# Altium schematic sheet 07_MCU.SchDoc: MCU
size A4; Author: Gabriel; Organization: Altium Limited; Address1: L3, 12a Rodborough Rd; Address2: Frenchs Forest; Address3: NSW; Address4: Australia 2086; Revision: v2.0; SheetNumber: 7; SheetTotal: 8; Subtitle: XDRONE
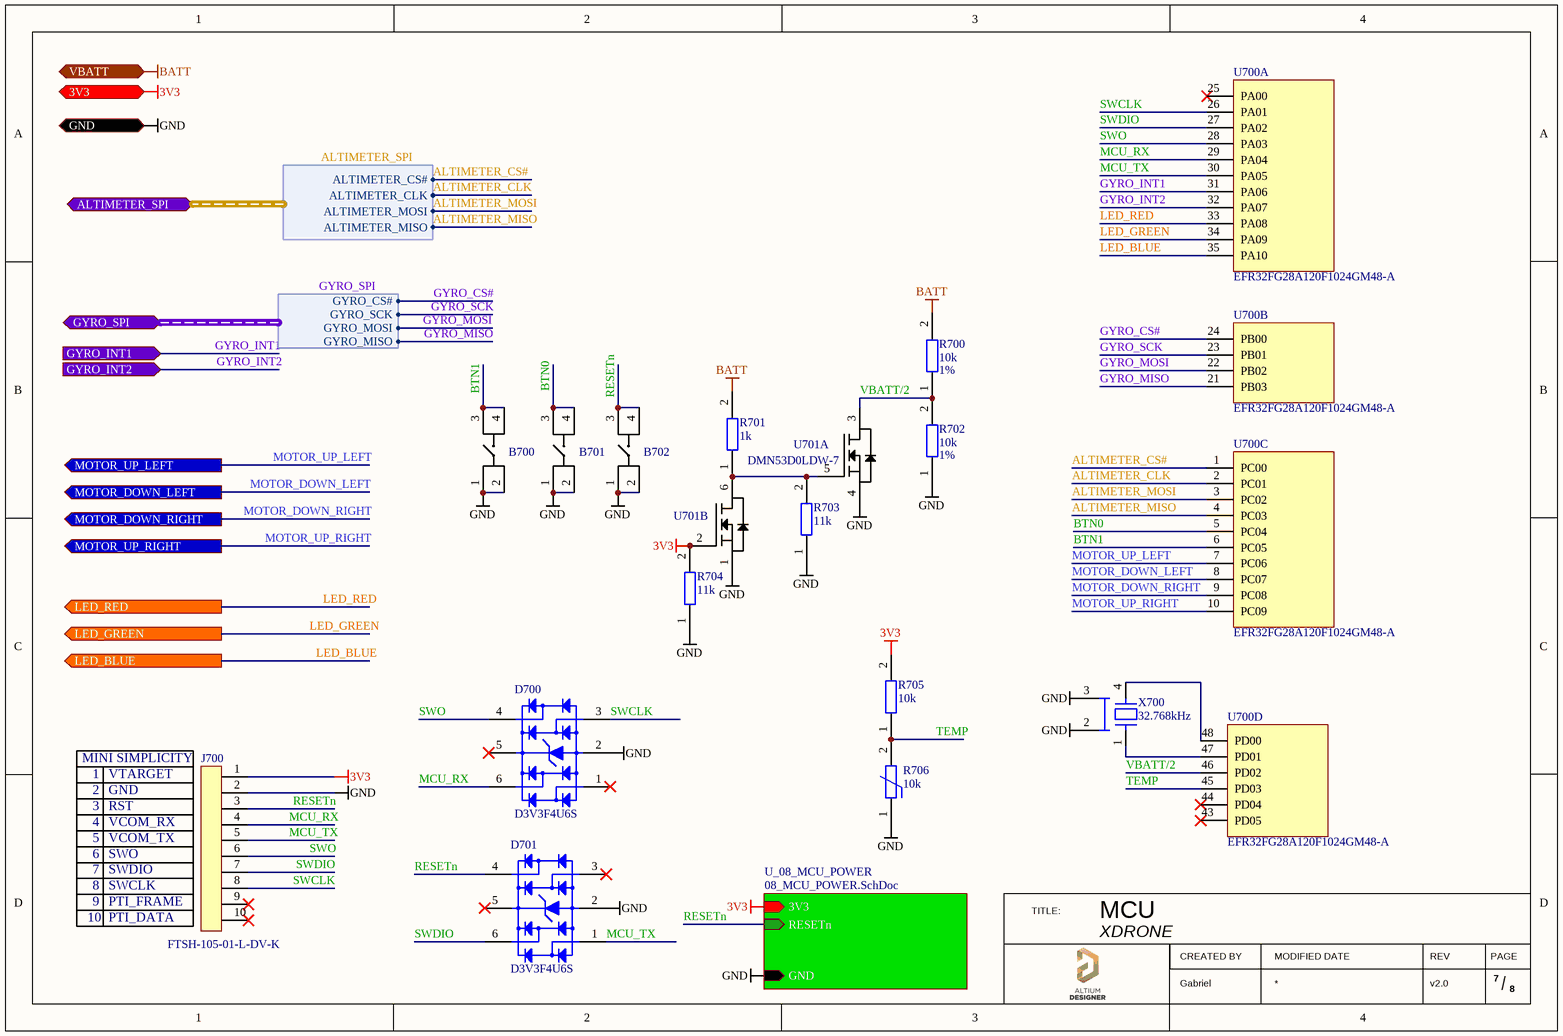
[diagram p0: 07_MCU.SchDoc]

## Parts
B700  BTN_1B_PTS647SK38SMTR2LFS  [BTN_SMD]  (value not drawn)
B701  BTN_1B_PTS647SK38SMTR2LFS  [BTN_SMD]  (value not drawn)
B702  BTN_1B_PTS647SK38SMTR2LFS  [BTN_SMD]  (value not drawn)
D700  MANUFACTURER REFERENCE: D3V3F4U6S  [SOT-363 SC-70-6]  (hidden comment: ESD_D3V3F4U6S)
D701  MANUFACTURER REFERENCE: D3V3F4U6S  [SOT-363 SC-70-6]  (hidden comment: ESD_D3V3F4U6S)
J700  MANUFACTURER REFERENCE: FTSH-105-01-L-DV-K  [CON_5x2PIN_RA_FTSH-105-01-L-DV-K]  (hidden comment: CON_5x2PIN_RA_1.27_FTSH-105-01-L-DV-K)
R700  value 10k  TOLERANCE: 1%  [RES_0402]  (hidden comment: RES_10k_1%_0402_RC0402FR-0710KL)
R701  value 1k  [RES_0402]  (hidden comment: RES_1k_1%_0402_RC0402FR-071KL)
R702  value 10k  TOLERANCE: 1%  [RES_0402]  (hidden comment: RES_10k_1%_0402_RC0402FR-0710KL)
R703  value 11k  [RES_0402]  (hidden comment: RES_11k_5%_0402_ERJ-2GEJ113X)
R704  value 11k  [RES_0402]  (hidden comment: RES_11k_5%_0402_ERJ-2GEJ113X)
R705  value 10k  [RES_0402]  (hidden comment: RES_10k_1%_0402_RC0402FR-0710KL)
R706  value 10k  [RES_0402]  (hidden comment: THER_10k_1%_0402_NTCG103JF103FT1)
U700  MANUFACTURER REFERENCE: EFR32FG28A120F1024GM48-A  [QFN48]  (hidden comment: MCU_1MB_256kB_EFR32FG28A120F1024GM48-A)  (parts A,B,C,D of 6)
U701  MANUFACTURER REFERENCE: DMN53D0LDW-7  [SOT-363 SC-70-6]  (hidden comment: MOS_2G_50VDS_360mA_0.8Vth_DMN53D0LDW-7)  (parts A,B of 2)
X700  FREQUENCY: 32.768kHz  [4-SOJ]  (hidden comment: QUARTZ_32.768kHz_20ppm_830016178)

## Sub-sheets
U_08_MCU_POWER = 08_MCU_POWER.SchDoc: GND (in), 3V3 (in), RESETn (in)

## Ports
3V3 (in), ALTIMETER_SPI (harness ALTIMETER_SPI), GND (in), GYRO_INT1 (in), GYRO_INT2 (in), GYRO_SPI (harness GYRO_SPI), LED_BLUE (out), LED_GREEN (out), LED_RED (out), MOTOR_DOWN_LEFT (out), MOTOR_DOWN_RIGHT (out), MOTOR_UP_LEFT (out), MOTOR_UP_RIGHT (out), VBATT (in)

## Harnesses
ALTIMETER_SPI: ALTIMETER_MISO, ALTIMETER_MOSI, ALTIMETER_CLK, ALTIMETER_CS#
GYRO_SPI: GYRO_CS#, GYRO_SCK, GYRO_MOSI, GYRO_MISO

## Nets
3V3: J700.1 R704.2 R705.2 U701.2 ; port 3V3, sheet U_08_MCU_POWER/3V3
BATT: R700.2 R701.2 ; port VBATT
GND: B700.1 B700.2 B701.1 B701.2 B702.1 B702.2 D700.2 D701.2 J700.2 R702.1 R703.1 R704.1 R706.1 U701.1 U701.4 X700.2 X700.3 ; port GND, sheet U_08_MCU_POWER/GND
ALTIMETER_CLK: U700.2(PC01) ; port ALTIMETER_SPI.ALTIMETER_CLK
ALTIMETER_CS#: U700.1(PC00) ; port ALTIMETER_SPI.ALTIMETER_CS#
ALTIMETER_MISO: U700.4(PC03) ; port ALTIMETER_SPI.ALTIMETER_MISO
ALTIMETER_MOSI: U700.3(PC02) ; port ALTIMETER_SPI.ALTIMETER_MOSI
BTN0: B701.3 B701.4 U700.5(PC04)
BTN1: B700.3 B700.4 U700.6(PC05)
GYRO_CS#: U700.24(PB00) ; port GYRO_SPI.GYRO_CS#
GYRO_INT1: U700.31(PA06) ; port GYRO_INT1
GYRO_INT2: U700.32(PA07) ; port GYRO_INT2
GYRO_MISO: U700.21(PB03) ; port GYRO_SPI.GYRO_MISO
GYRO_MOSI: U700.22(PB02) ; port GYRO_SPI.GYRO_MOSI
GYRO_SCK: U700.23(PB01) ; port GYRO_SPI.GYRO_SCK
LED_BLUE: U700.35(PA10) ; port LED_BLUE
LED_GREEN: U700.34(PA09) ; port LED_GREEN
LED_RED: U700.33(PA08) ; port LED_RED
MCU_RX: D700.6 J700.4 U700.29(PA04)
MCU_TX: D701.1 J700.5 U700.30(PA05)
MOTOR_DOWN_LEFT: U700.8(PC07) ; port MOTOR_DOWN_LEFT
MOTOR_DOWN_RIGHT: U700.9(PC08) ; port MOTOR_DOWN_RIGHT
MOTOR_UP_LEFT: U700.7(PC06) ; port MOTOR_UP_LEFT
MOTOR_UP_RIGHT: U700.10(PC09) ; port MOTOR_UP_RIGHT
RESETn: B702.3 B702.4 D701.4 J700.3 ; sheet U_08_MCU_POWER/RESETn
SWCLK: D700.3 J700.8 U700.26(PA01)
SWDIO: D701.6 J700.7 U700.27(PA02)
SWO: D700.4 J700.6 U700.28(PA03)
TEMP: R705.1 R706.2 U700.45(PD03)
VBATT/2: R700.1 R702.2 U700.46(PD02) U701.3
NetR701_1: R701.1 R703.2 U701.5 U701.6
NetU700_47: U700.47(PD01) X700.1
NetU700_48: U700.48(PD00) X700.4

Not connected (* = marked no-connect by the designer): D700 1* 5*; D701 3* 5*; J700 9* 10*; U700 25(PA00)* 43(PD05)* 44(PD04)*

## Notes on the sheet
- (near J700) MINI SIMPLICITY
- 1
- VTARGET
- 2
- 3
- 4
- 5
- GND
- RST
- VCOM_RX
- VCOM_TX
- 10
- 6
- 7
- 8
- 9
- SWO
- SWDIO
- SWCLK
- (near J700) PTI_FRAME
- PTI_DATA
- TITLE:
- CREATED BY
- MODIFIED DATE
- REV
- PAGE
- /

## Library data of the parts
B700-B702 = BTN_1B_PTS647SK38SMTR2LFS: Button PTS647SK38SMTR2LFS; MANUFACTURER: C&K; NUMBER OF BUTTONS: 1; DIRECTION: STRAIGHT; MOUNTING: SMD; MANUFACTURER REFERENCE: PTS647SK38SMTR2LFS
D700 D701 = ESD_D3V3F4U6S: 4 CH ESD PROTECTION SOT363 LOW CAP D3V3F4U6S; MANUFACTURER: DIODES INC; DRAW BY: ToV; LATEST REVISION NOTE: CREATION; VF DIODE: 1.1V; NB OF CHANNEL: 4; UL94: V-0; DRAW DATE: 02/05/2022; LATEST REVISION DATE: 02/05/2022; STATUS: ACTIVE; OPERATING TEMPERATURE: -55 +150°C; TYPE: ESD; PEAK CURRENT: --; AVERAGE CURRENT: *; MAX POWER DISSIPATION: --; ROHS: ROHS; WEIGHT (g): 0.006; MOUNTING: SMD; PACKAGING: SOT363
J700 = CON_5x2PIN_RA_1.27_FTSH-105-01-L-DV-K: CONNECTOR 5x2PIN RA 1.27 PITCH FTSH-105-01-L-DV-K; MANUFACTURER: SAMTEC; CURRENT RATING: 3A; PITCH: 1.27 mm; GENDER: MALE; ROWS: 2; COLUMNS: 5; ROW SPACING: 1.27; MOUNTING: SMD; ANGLE: RA
R700 R702 R705 = RES_10k_1%_0402_RC0402FR-0710KL: RESISTOR 10k 1% 0402 RC0402FR-0710KL; MANUFACTURER: YAGEO; VOLTAGE RATING: 50V; MOUNTING: SMD; MANUFACTURER REFERENCE: RC0402FR-0710KL; PACKAGING: 0402
  R705: TOLERANCE: 1%
R701 = RES_1k_1%_0402_RC0402FR-071KL: RESISTOR 1k 1% 0402 RC0402FR-071KL; MANUFACTURER: YAGEO; VOLTAGE RATING: 50V; TOLERANCE: 1%; MOUNTING: SMD; MANUFACTURER REFERENCE: RC0402FR-071KL; PACKAGING: 0402
R703 R704 = RES_11k_5%_0402_ERJ-2GEJ113X: RESISTOR 11k 5% 0402 ERJ-2GEJ113X; MANUFACTURER: PANASONIC; VOLTAGE RATING: 50V; TOLERANCE: 5%; MOUNTING: SMD; MANUFACTURER REFERENCE: ERJ-2GEJ113X; PACKAGING: 0402
R706 = THER_10k_1%_0402_NTCG103JF103FT1: THERMISTANCE 10k 1% 0402 NTCG103JF103FT1; MANUFACTURER: TDK; VOLTAGE RATING: 50V; TOLERANCE: 1%; MOUNTING: SMD; MANUFACTURER REFERENCE: NTCG103JF103FT1; PACKAGING: 0402
U700 = MCU_1MB_256kB_EFR32FG28A120F1024GM48-A: MCU 1MB 256kB EFR32FG28A120F1024GM48-A; MANUFACTURER: SILICON LABS; PACKAGING: QFN48 0606; FLASH SIZE: 1 MB; RAM SIZE: 256 KB; PIN COUNT: 48; MOUNTING: SMD
U701 = MOS_2G_50VDS_360mA_0.8Vth_DMN53D0LDW-7: MOS 2GATES 50VDS 360mA 0.8Vth; MANUFACTURER: DIODES; VOLTAGE DS MAX: 50; NUMBER OF GATES: 2; VOLTAGE THRESHOLD: 0.8V; CURRENT MAX: 360mA; PACKAGING: SOT-363-6; MOUNTING: SMD
X700 = QUARTZ_32.768kHz_20ppm_830016178: QUARTZ 32.768kHz 20ppm 830016178; MANUFACTURER: WURTH; MANUFACTURER REFERENCE: 830016178; MOUNTING: SMD; PACKAGING: 4-SOJ; TOLERANCE: 20 ppm